# EAGLE schematic pepino4 (EAGLE 6.3)

## Sheet 1 of 4
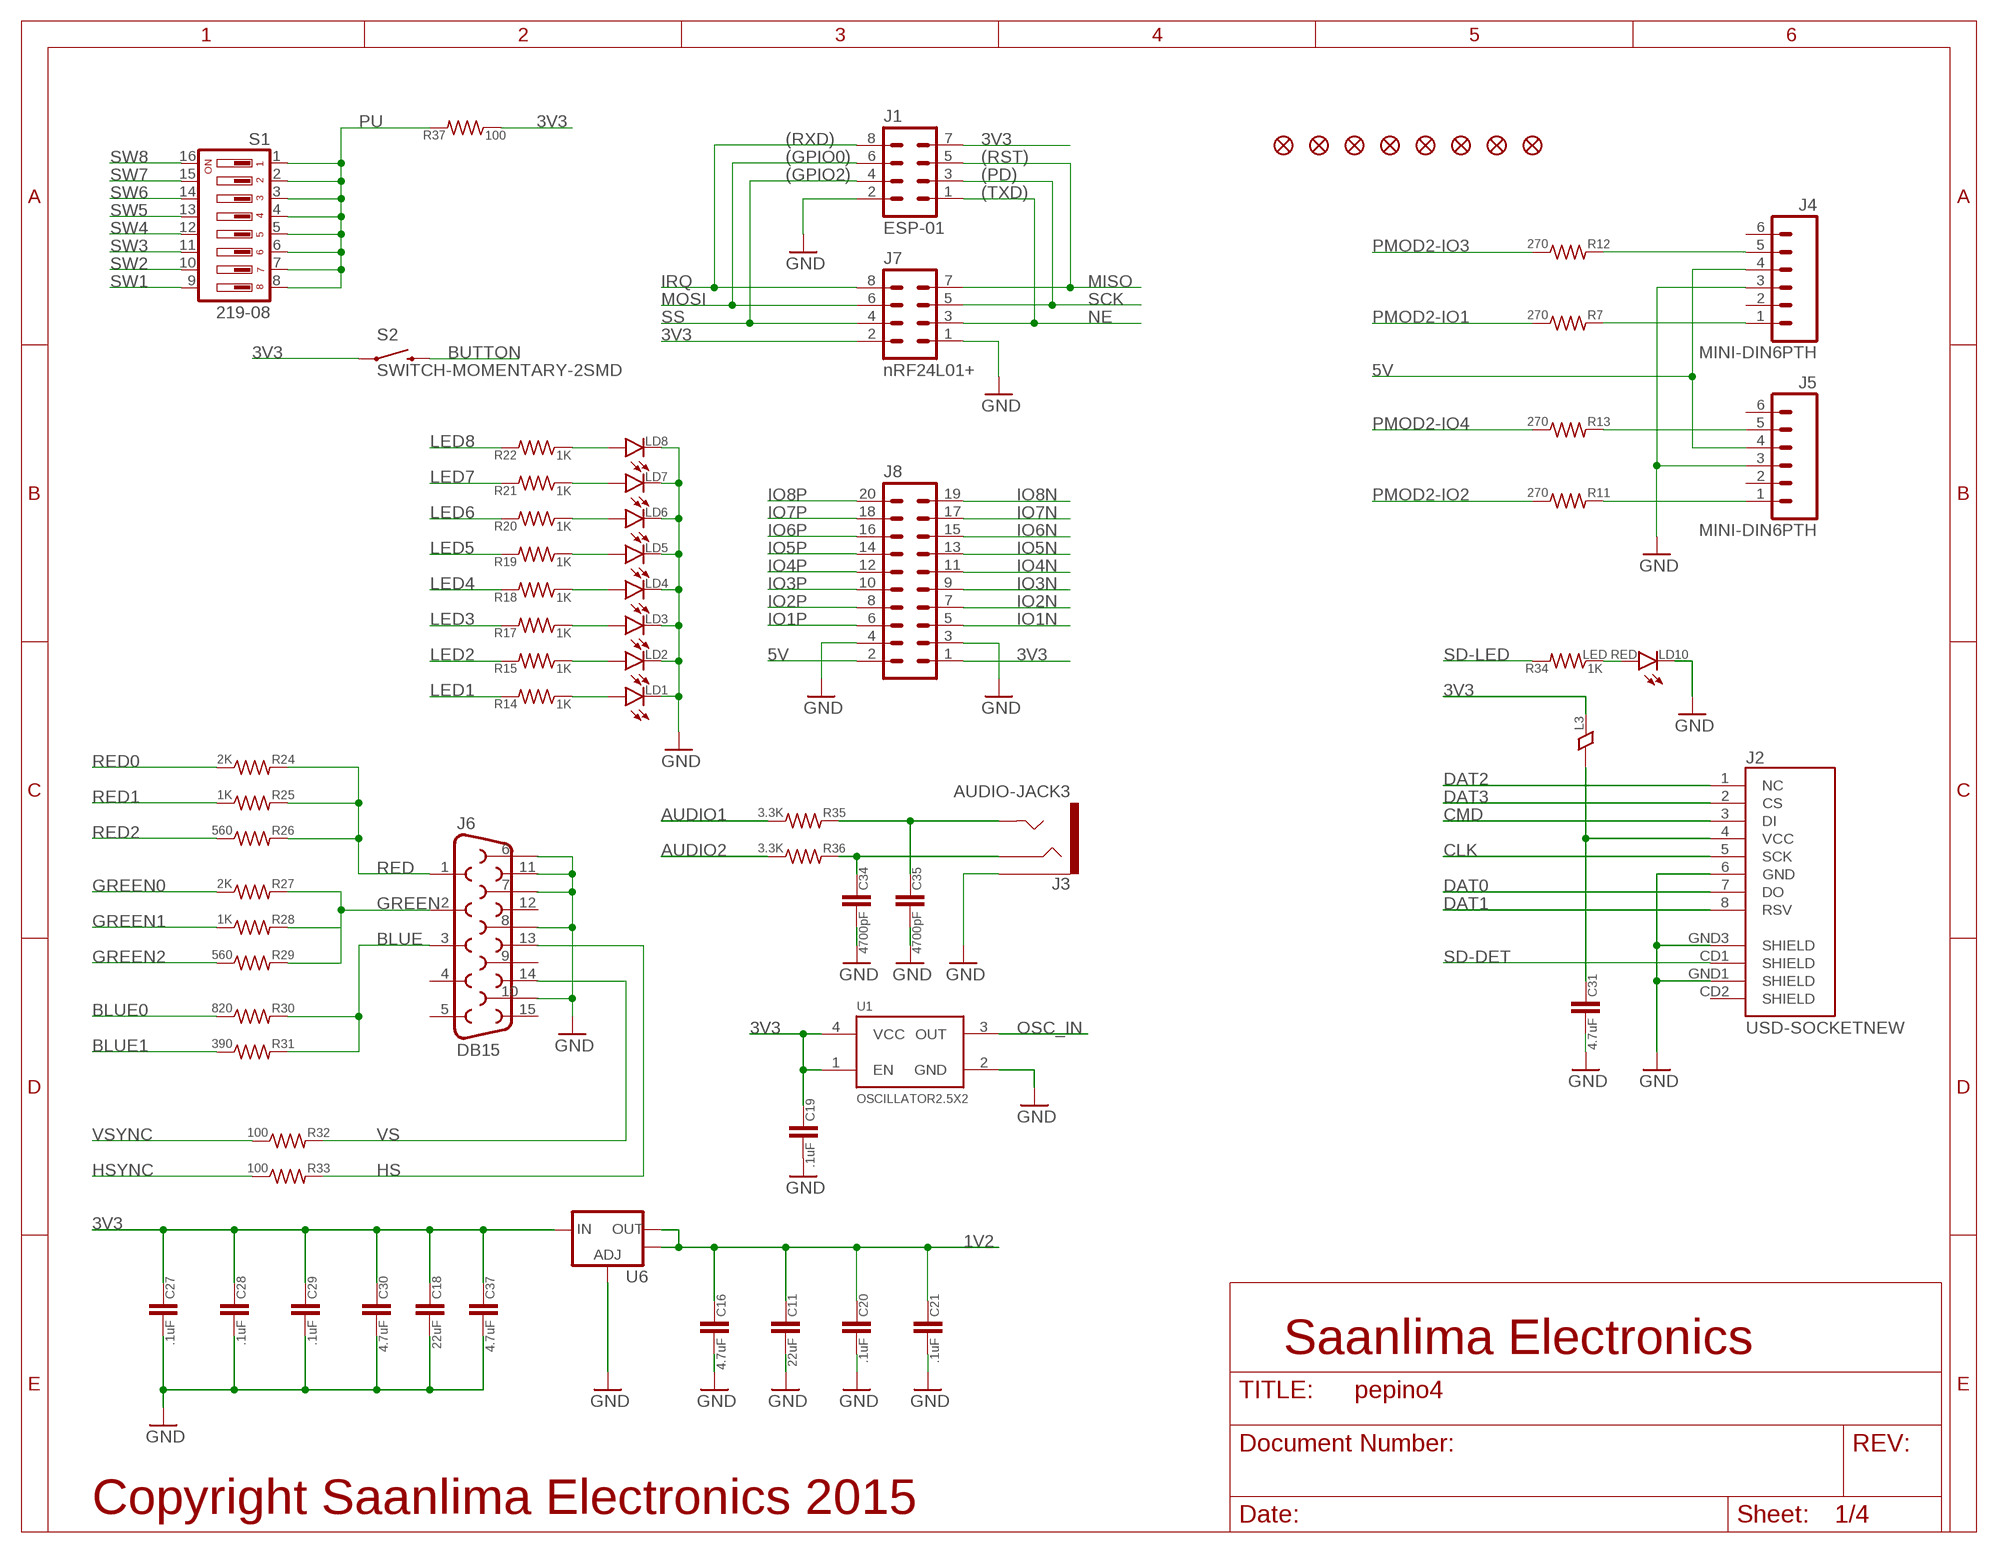
[diagram p0: schematic, sheet 1]

### Parts
C11  22uF  C0805  [0805]
C16  4.7uF  C0402  [0402]
C18  22uF  C0805  [0805]
C19  .1uF  C0402  [0402]
C20  .1uF  C0402  [0402]
C21  .1uF  C0402  [0402]
C27  .1uF  C0402  [0402]
C28  .1uF  C0402  [0402]
C29  .1uF  C0402  [0402]
C30  4.7uF  C0402  [0402]
C31  4.7uF  C0402  [0402]
C34  4700pF  C0402  [0402]
C35  4700pF  C0402  [0402]
C37  4.7uF  C0402  [0402]
J1  ESP-01  MA04-2  [MA04-2]
J2  USD-SOCKETNEW  [MICRO-SD-SOCKET-PP]
J3  AUDIO-JACK3  [AUDIO-JACK-3.5MM-3]
J4  MINI-DIN6PTH  [MINI-DIN6]
J5  MINI-DIN6PTH  [MINI-DIN6]
J6  DB15  [DB15]
J7  nRF24L01+  MA04-2  [MA04-2]
J8  MA10-2  [MA10-2]
JP1  FIDUCIAL1X2  [FIDUCIAL-1X2]
JP2  FIDUCIAL1X2  [FIDUCIAL-1X2]
JP3  FIDUCIAL1X2  [FIDUCIAL-1X2]
JP4  FIDUCIAL1X2  [FIDUCIAL-1X2]
JP5  FIDUCIAL1X2  [FIDUCIAL-1X2]
JP6  FIDUCIAL1X2  [FIDUCIAL-1X2]
JP7  FIDUCIAL1X2  [FIDUCIAL-1X2]
JP8  FIDUCIAL1X2  [FIDUCIAL-1X2]
L3  FERRITE0402  [0402]
LD1  LED0805  [0805_POL]
LD2  LED0805  [0805_POL]
LD3  LED0805  [0805_POL]
LD4  LED0805  [0805_POL]
LD5  LED0805  [0805_POL]
LD6  LED0805  [0805_POL]
LD7  LED0805  [0805_POL]
LD8  LED0805  [0805_POL]
LD10  LED RED  LED0805  [0805_POL]
R7  270  R0402  [0402]
R11  270  R0402  [0402]
R12  270  R0402  [0402]
R13  270  R0402  [0402]
R14  1K  R0402  [0402]
R15  1K  R0402  [0402]
R17  1K  R0402  [0402]
R18  1K  R0402  [0402]
R19  1K  R0402  [0402]
R20  1K  R0402  [0402]
R21  1K  R0402  [0402]
R22  1K  R0402  [0402]
R24  2K  R0402  [0402]
R25  1K  R0402  [0402]
R26  560  R0402  [0402]
R27  2K  R0402  [0402]
R28  1K  R0402  [0402]
R29  560  R0402  [0402]
R30  820  R0402  [0402]
R31  390  R0402  [0402]
R32  100  R0402  [0402]
R33  100  R0402  [0402]
R34  1K  R0402  [0402]
R35  3.3K  R0402  [0402]
R36  3.3K  R0402  [0402]
R37  100  R0402  [0402]
S1  219-08  [CTS-219-08]
S2  SWITCH-MOMENTARY-2SMD  [TACTILE_SWITCH_SMD]
U1  OSCILLATOR2.5X2  [CRYSTAL-OSC-SMD-2.5X2]
U6  V_REG_LM1117SOT223  [SOT223]

### Nets
1V2: C11.1 C16.1 C20.1 C21.1 U6.2(OUT) U6.4(OUT) ; also sheet 4
3V3: C18.1 C19.1 C27.1 C28.1 C29.1 C30.1 C37.1 J1.7 J7.2 J8.1 L3.2 R37.1 S2.1 U1.1(EN) U1.4(VCC) U6.3(IN) ; also sheet 2,3,4
5V: J4.4 J5.4 J8.2 ; also sheet 2
AUDIO1: R35.1 ; also sheet 4
AUDIO2: R36.1 ; also sheet 4
BLUE: J6.3 R30.2 R31.2
BLUE0: R30.1 ; also sheet 4
BLUE1: R31.1 ; also sheet 4
BUTTON: S2.3 ; also sheet 4
CLK: J2.5(SCK) ; also sheet 4
CMD: J2.3(DI) ; also sheet 4
DAT0: J2.7(DO) ; also sheet 4
DAT1: J2.8(RSV) ; also sheet 4
DAT2: J2.1(NC) ; also sheet 4
DAT3: J2.2(CS) ; also sheet 4
GND: C11.2 C16.2 C18.2 C19.2 C20.2 C21.2 C27.2 C28.2 C29.2 C30.2 C31.2 C34.2 C35.2 C37.2 J1.2 J2.6(GND) J2.GND1(SHIELD) J2.GND3(SHIELD) J3.SLEEVE J4.3 J5.3 J6.6 J6.7 J6.8 J6.10 J6.11 J7.1 J8.3 J8.4 LD1.-(C) LD2.-(C) LD3.-(C) LD4.-(C) LD5.-(C) LD6.-(C) LD7.-(C) LD8.-(C) LD10.-(C) U1.2(GND) U6.1(ADJ) ; also sheet 2,3,4
GREEN: J6.2 R27.2 R28.2 R29.2
GREEN0: R27.1 ; also sheet 4
GREEN1: R28.1 ; also sheet 4
GREEN2: R29.1 ; also sheet 4
HS: J6.13 R33.2
HSYNC: R33.1 ; also sheet 4
IO1N: J8.5 ; also sheet 4
IO1P: J8.6 ; also sheet 4
IO2N: J8.7 ; also sheet 4
IO2P: J8.8 ; also sheet 4
IO3N: J8.9 ; also sheet 4
IO3P: J8.10 ; also sheet 4
IO4N: J8.11 ; also sheet 4
IO4P: J8.12 ; also sheet 4
IO5N: J8.13 ; also sheet 4
IO5P: J8.14 ; also sheet 4
IO6N: J8.15 ; also sheet 4
IO6P: J8.16 ; also sheet 4
IO7N: J8.17 ; also sheet 4
IO7P: J8.18 ; also sheet 4
IO8N: J8.19 ; also sheet 4
IO8P: J8.20 ; also sheet 4
IRQ: J1.8 J7.8 ; also sheet 4
LED1: R14.2 ; also sheet 4
LED2: R15.2 ; also sheet 4
LED3: R17.2 ; also sheet 4
LED4: R18.2 ; also sheet 4
LED5: R19.2 ; also sheet 4
LED6: R20.2 ; also sheet 4
LED7: R21.2 ; also sheet 4
LED8: R22.2 ; also sheet 4
MISO: J1.5 J7.7 ; also sheet 4
MOSI: J1.6 J7.6 ; also sheet 4
N$1: J4.1 R7.2
N$4: J5.1 R11.2
N$6: J4.5 R12.2
N$7: C31.1 J2.4(VCC) L3.1
N$8: J5.5 R13.2
N$12: LD1.+(A) R14.1
N$15: LD7.+(A) R21.1
N$22: LD2.+(A) R15.1
N$23: LD3.+(A) R17.1
N$24: LD4.+(A) R18.1
N$25: LD5.+(A) R19.1
N$26: LD6.+(A) R20.1
N$28: LD8.+(A) R22.1
N$29: LD10.+(A) R34.1
N$30: C34.1 J3.RING R36.2
N$31: C35.1 J3.TIP R35.2
NE: J1.1 J7.3 ; also sheet 4
OSC_IN: U1.3(OUT) ; also sheet 4
PMOD2-IO1: R7.1 ; also sheet 4
PMOD2-IO2: R11.1 ; also sheet 4
PMOD2-IO3: R12.1 ; also sheet 4
PMOD2-IO4: R13.1 ; also sheet 4
PU: R37.2 S1.1 S1.2 S1.3 S1.4 S1.5 S1.6 S1.7 S1.8
RED: J6.1 R24.2 R25.2 R26.2
RED0: R24.1 ; also sheet 4
RED1: R25.1 ; also sheet 4
RED2: R26.1 ; also sheet 4
SCK: J1.3 J7.5 ; also sheet 4
SD-DET: J2.CD1(SHIELD) ; also sheet 4
SD-LED: R34.2 ; also sheet 4
SS: J1.4 J7.4 ; also sheet 4
SW1: S1.9 ; also sheet 4
SW2: S1.10 ; also sheet 4
SW3: S1.11 ; also sheet 4
SW4: S1.12 ; also sheet 4
SW5: S1.13 ; also sheet 4
SW6: S1.14 ; also sheet 4
SW7: S1.15 ; also sheet 4
SW8: S1.16 ; also sheet 4
VS: J6.14 R32.2
VSYNC: R32.1 ; also sheet 4
Unconnected: J2.CD2(SHIELD) J4.2 J4.6 J5.2 J5.6 J6.4 J6.5 J6.9 J6.12 J6.15

### Notes on the sheet
- (RXD)
- (GPIO0) | (RST)
- (GPIO2) | (PD)
- (TXD)
- Saanlima Electronics
- Copyright Saanlima Electronics 2015

## Sheet 2 of 4
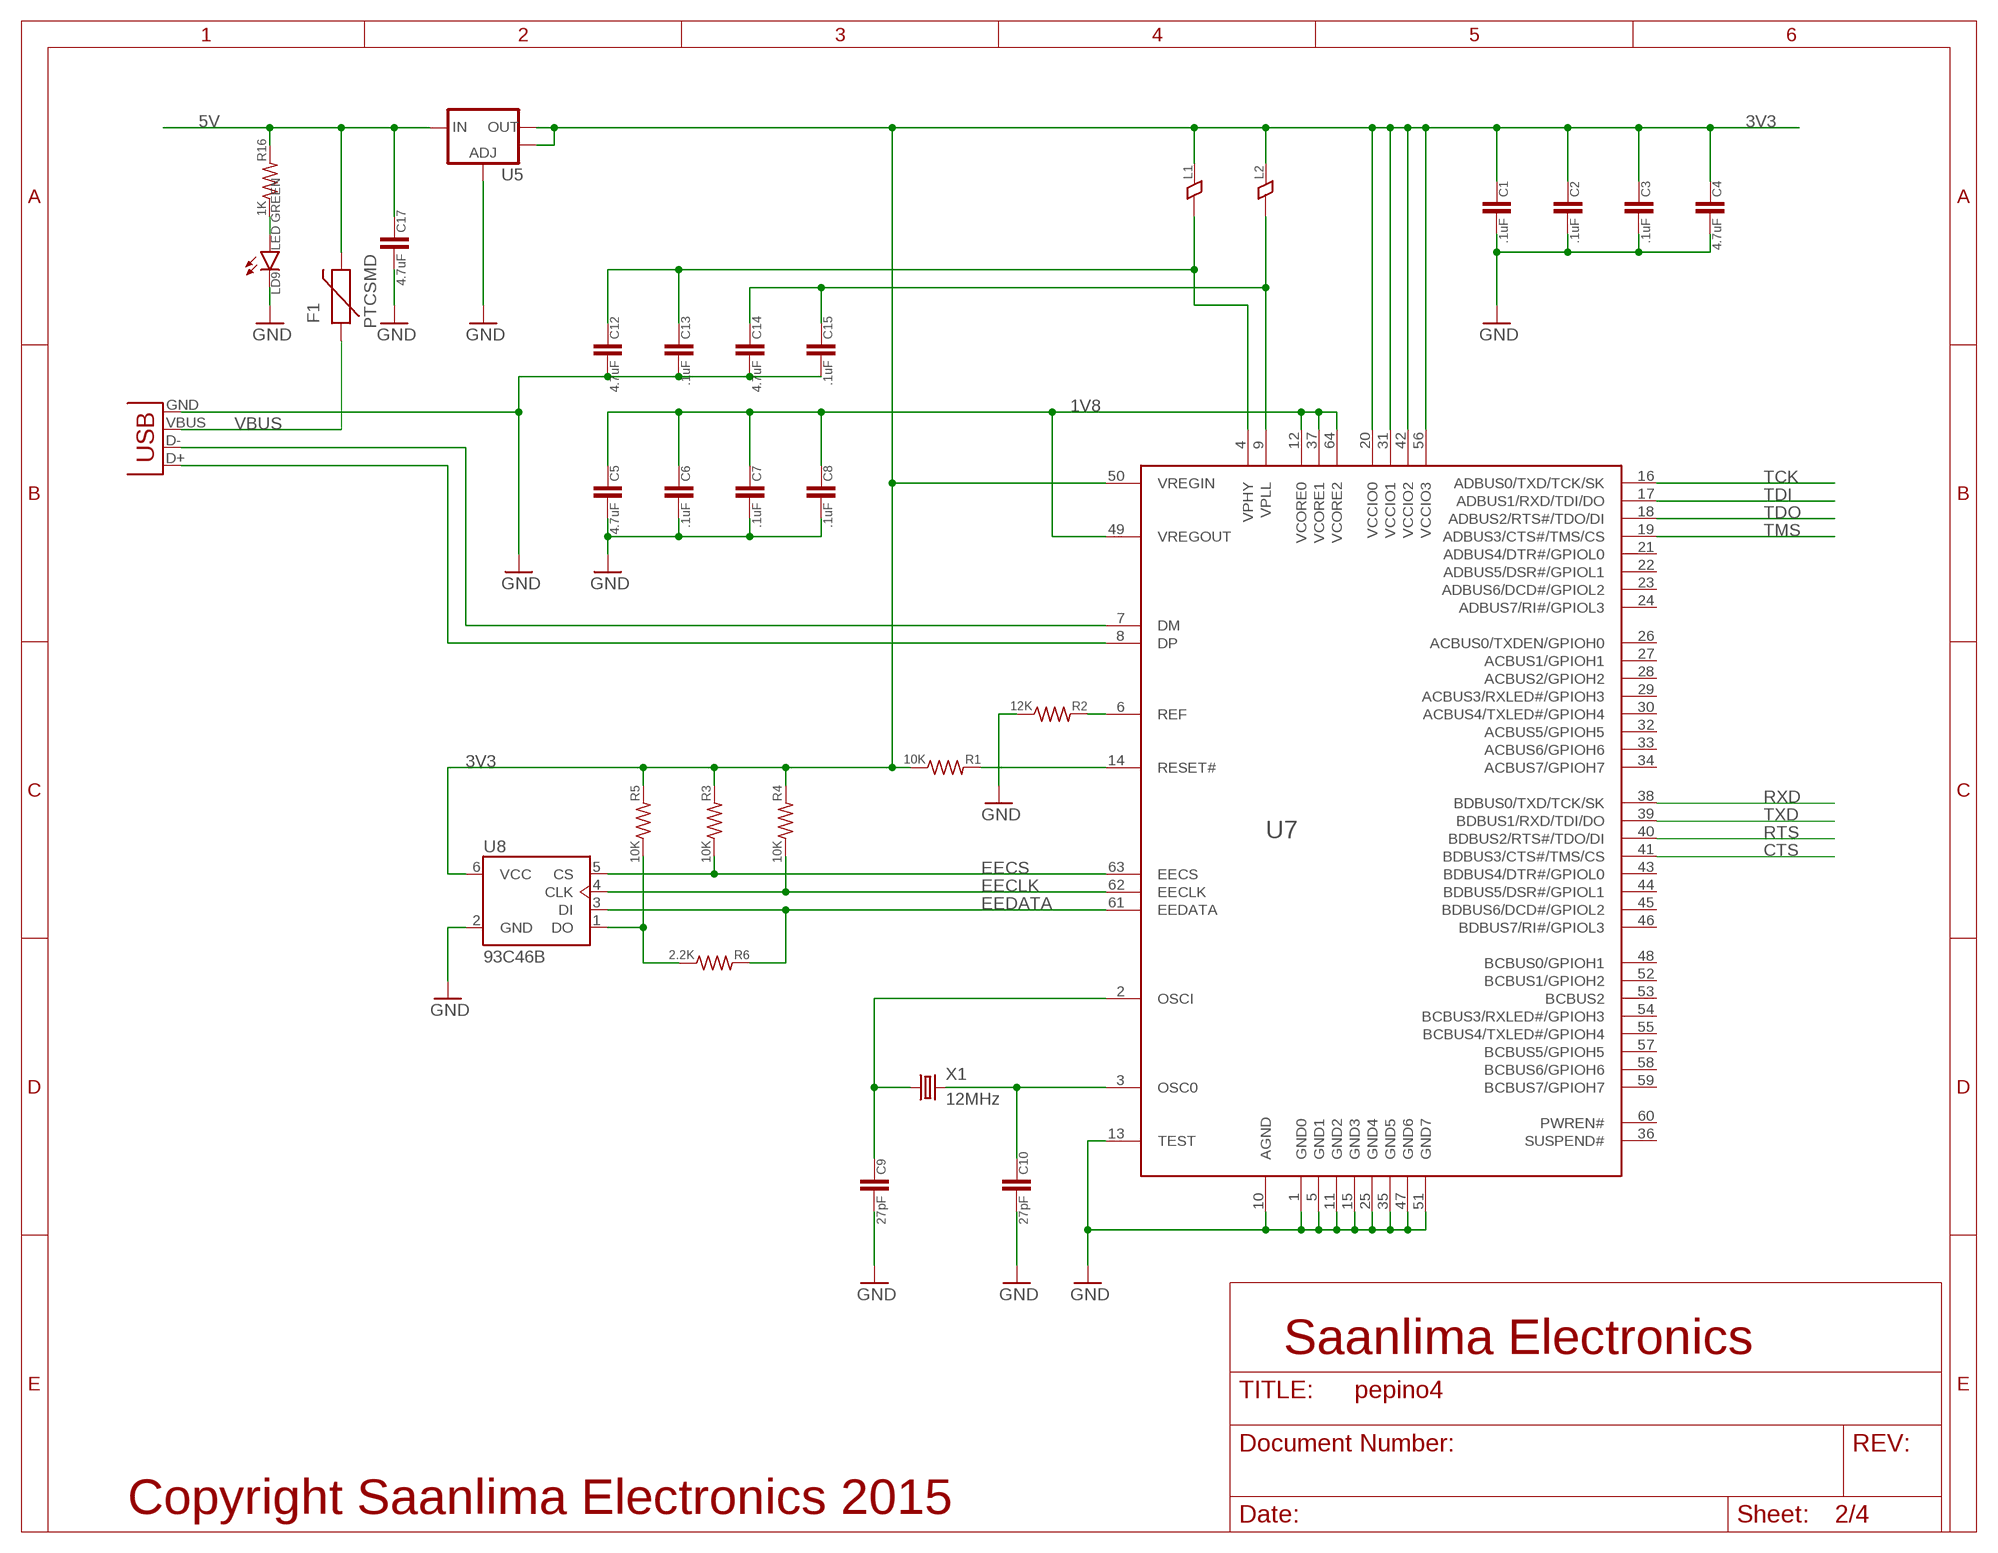
[diagram p1: schematic, sheet 2]

### Parts
C1  .1uF  C0402  [0402]
C2  .1uF  C0402  [0402]
C3  .1uF  C0402  [0402]
C4  4.7uF  C0402  [0402]
C5  4.7uF  C0402  [0402]
C6  .1uF  C0402  [0402]
C7  .1uF  C0402  [0402]
C8  .1uF  C0402  [0402]
C9  27pF  C0402  [0402]
C10  27pF  C0402  [0402]
C12  4.7uF  C0402  [0402]
C13  .1uF  C0402  [0402]
C14  4.7uF  C0402  [0402]
C15  .1uF  C0402  [0402]
C17  4.7uF  C0603  [0603]
F1  PTCSMD  [PTC-1206]
J9  USBSMD  [USB-MINIB]
L1  FERRITE0402  [0402]
L2  FERRITE0402  [0402]
LD9  LED GREEN  LED0805  [0805_POL]
R1  10K  R0402  [0402]
R2  12K  R0402  [0402]
R3  10K  R0402  [0402]
R4  10K  R0402  [0402]
R5  10K  R0402  [0402]
R6  2.2K  R0402  [0402]
R16  1K  R0402  [0402]
U5  V_REG_LM1117SOT223  [SOT223]
U7  DP-EAGLELIBRARY_FT2232H  [DP-EAGLELIBRARY_LQFP64]
U8  93C46B  DIGITAL-EEPROM-MICROWIRE-6P_SOT23  [SOT23-6]
X1  12MHz  CRYSTAL3.2X2.5  [CRYSTAL3.2X2.5MM]

### Nets
1V8: C5.1 C6.1 C7.1 C8.1 U7.12(VCORE0) U7.37(VCORE1) U7.49(VREGOUT) U7.64(VCORE2)
3V3: C1.1 C2.1 C3.1 C4.1 L1.2 L2.2 R1.1 R3.2 R4.2 R5.2 U5.2(OUT) U5.4(OUT) U7.20(VCCIO0) U7.31(VCCIO1) U7.42(VCCIO2) U7.50(VREGIN) U7.56(VCCIO3) U8.6(VCC) ; also sheet 1,3,4
5V: C17.1 F1.2 R16.2 U5.3(IN) ; also sheet 1
CTS: U7.41(BDBUS3/CTS#/TMS/CS) ; also sheet 4
EECLK: R4.1 U7.62(EECLK) U8.4(CLK)
EECS: R3.1 U7.63(EECS) U8.5(CS)
EEDATA: R6.2 U7.61(EEDATA) U8.3(DI)
GND: C1.2 C2.2 C3.2 C4.2 C5.2 C6.2 C7.2 C8.2 C9.2 C10.2 C12.2 C13.2 C14.2 C15.2 C17.2 J9.GND LD9.-(C) R2.1 U5.1(ADJ) U7.1(GND0) U7.5(GND1) U7.10(AGND) U7.11(GND2) U7.13(TEST) U7.15(GND3) U7.25(GND4) U7.35(GND5) U7.47(GND6) U7.51(GND7) U8.2(GND) ; also sheet 1,3,4
N$9: C9.1 U7.2(OSCI) X1.1
N$10: C10.1 U7.3(OSC0) X1.3
N$11: LD9.+(A) R16.1
N$13: J9.D- U7.7(DM)
N$14: J9.D+ U7.8(DP)
N$18: C14.1 C15.1 L2.1 U7.9(VPLL)
N$19: R1.2 U7.14(RESET#)
N$20: R2.2 U7.6(REF)
N$21: C12.1 C13.1 L1.1 U7.4(VPHY)
N$27: R5.1 R6.1 U8.1(DO)
RTS: U7.40(BDBUS2/RTS#/TDO/DI) ; also sheet 4
RXD: U7.38(BDBUS0/TXD/TCK/SK) ; also sheet 4
TCK: U7.16(ADBUS0/TXD/TCK/SK) ; also sheet 4
TDI: U7.17(ADBUS1/RXD/TDI/DO) ; also sheet 4
TDO: U7.18(ADBUS2/RTS#/TDO/DI) ; also sheet 4
TMS: U7.19(ADBUS3/CTS#/TMS/CS) ; also sheet 4
TXD: U7.39(BDBUS1/RXD/TDI/DO) ; also sheet 4
VBUS [power]: F1.1 J9.VBUS
Unconnected: U7.21(ADBUS4/DTR#/GPIOL0) U7.22(ADBUS5/DSR#/GPIOL1) U7.23(ADBUS6/DCD#/GPIOL2) U7.24(ADBUS7/RI#/GPIOL3) U7.26(ACBUS0/TXDEN/GPIOH0) U7.27(ACBUS1/GPIOH1) U7.28(ACBUS2/GPIOH2) U7.29(ACBUS3/RXLED#/GPIOH3) U7.30(ACBUS4/TXLED#/GPIOH4) U7.32(ACBUS5/GPIOH5) U7.33(ACBUS6/GPIOH6) U7.34(ACBUS7/GPIOH7) U7.36(SUSPEND#) U7.43(BDBUS4/DTR#/GPIOL0) U7.44(BDBUS5/DSR#/GPIOL1) U7.45(BDBUS6/DCD#/GPIOL2) U7.46(BDBUS7/RI#/GPIOL3) U7.48(BCBUS0/GPIOH1) U7.52(BCBUS1/GPIOH2) U7.53(BCBUS2) U7.54(BCBUS3/RXLED#/GPIOH3) U7.55(BCBUS4/TXLED#/GPIOH4) U7.57(BCBUS5/GPIOH5) U7.58(BCBUS6/GPIOH6) U7.59(BCBUS7/GPIOH7) U7.60(PWREN#)

### Notes on the sheet
- Saanlima Electronics
- Copyright Saanlima Electronics 2015

## Sheet 3 of 4
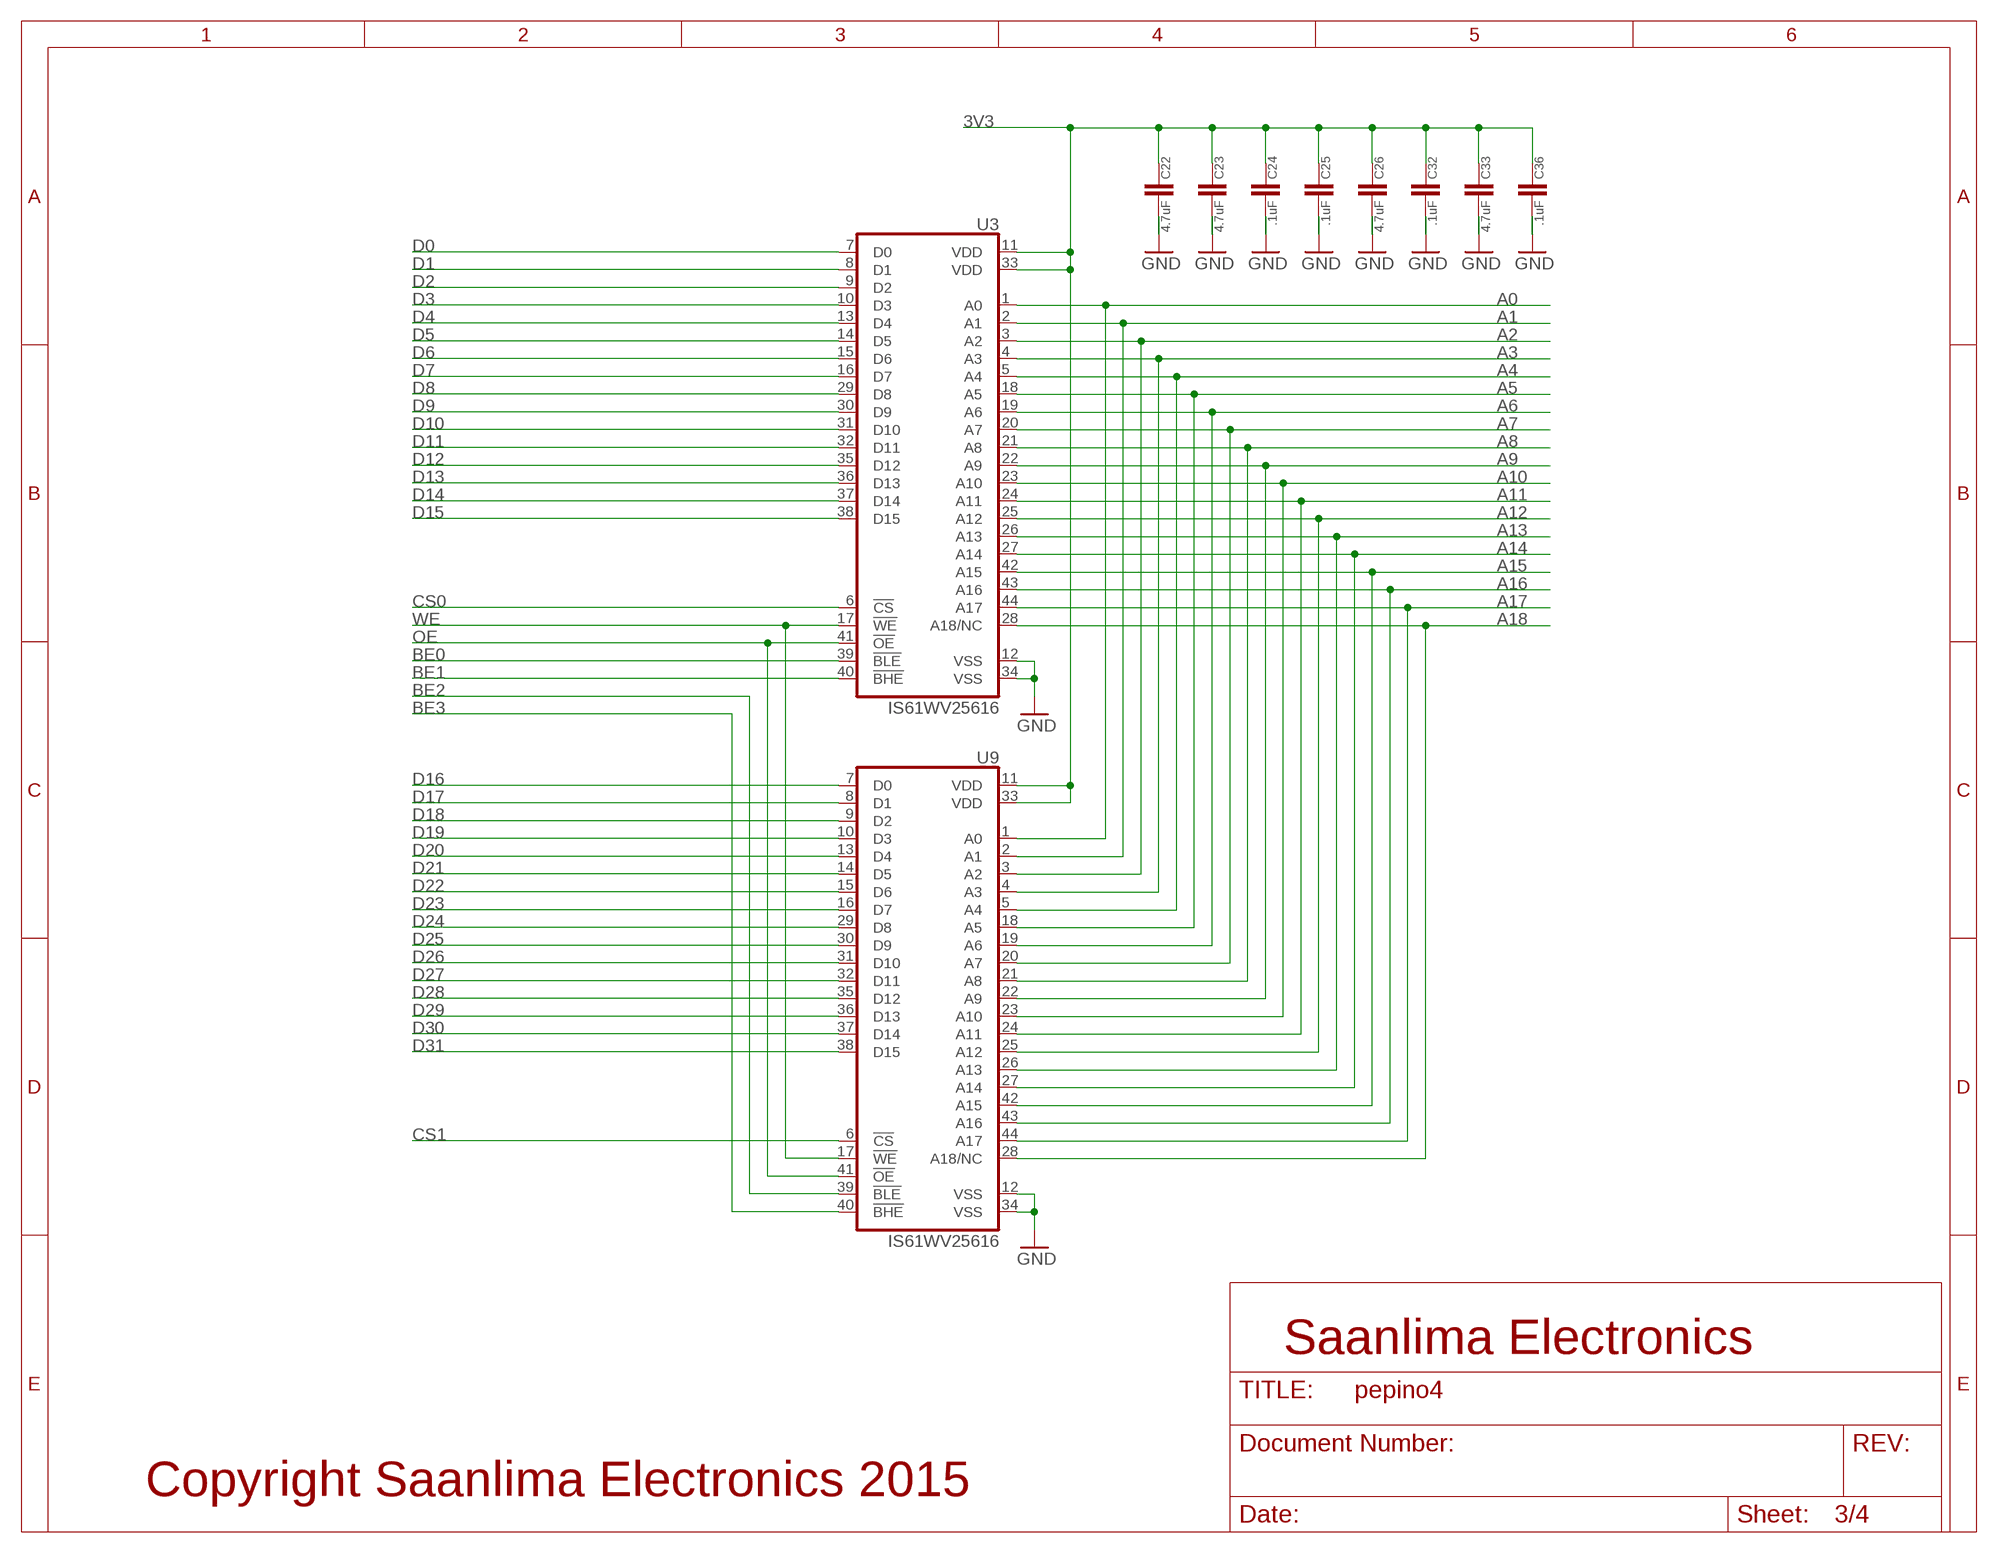
[diagram p2: schematic, sheet 3]

### Parts
C22  4.7uF  C0402  [0402]
C23  4.7uF  C0402  [0402]
C24  .1uF  C0402  [0402]
C25  .1uF  C0402  [0402]
C26  4.7uF  C0402  [0402]
C32  .1uF  C0402  [0402]
C33  4.7uF  C0402  [0402]
C36  .1uF  C0402  [0402]
U3  IS61WV25616  DIGITAL_4MB_SRAM  [TSOP44-II]
U9  IS61WV25616  DIGITAL_4MB_SRAM  [TSOP44-II]

### Nets
3V3: C22.1 C23.1 C24.1 C25.1 C26.1 C32.1 C33.1 C36.1 U3.11(VDD) U3.33(VDD) U9.11(VDD) U9.33(VDD) ; also sheet 1,2,4
A0: U3.1(A0) U9.1(A0) ; also sheet 4
A1: U3.2(A1) U9.2(A1) ; also sheet 4
A2: U3.3(A2) U9.3(A2) ; also sheet 4
A3: U3.4(A3) U9.4(A3) ; also sheet 4
A4: U3.5(A4) U9.5(A4) ; also sheet 4
A5: U3.18(A5) U9.18(A5) ; also sheet 4
A6: U3.19(A6) U9.19(A6) ; also sheet 4
A7: U3.20(A7) U9.20(A7) ; also sheet 4
A8: U3.21(A8) U9.21(A8) ; also sheet 4
A9: U3.22(A9) U9.22(A9) ; also sheet 4
A10: U3.23(A10) U9.23(A10) ; also sheet 4
A11: U3.24(A11) U9.24(A11) ; also sheet 4
A12: U3.25(A12) U9.25(A12) ; also sheet 4
A13: U3.26(A13) U9.26(A13) ; also sheet 4
A14: U3.27(A14) U9.27(A14) ; also sheet 4
A15: U3.42(A15) U9.42(A15) ; also sheet 4
A16: U3.43(A16) U9.43(A16) ; also sheet 4
A17: U3.44(A17) U9.44(A17) ; also sheet 4
A18: U3.28(A18/NC) U9.28(A18/NC) ; also sheet 4
BE0: U3.39(!BLE) ; also sheet 4
BE1: U3.40(!BHE) ; also sheet 4
BE2: U9.39(!BLE) ; also sheet 4
BE3: U9.40(!BHE) ; also sheet 4
CS0: U3.6(!CS) ; also sheet 4
CS1: U9.6(!CS) ; also sheet 4
D0: U3.7(D0) ; also sheet 4
D1: U3.8(D1) ; also sheet 4
D2: U3.9(D2) ; also sheet 4
D3: U3.10(D3) ; also sheet 4
D4: U3.13(D4) ; also sheet 4
D5: U3.14(D5) ; also sheet 4
D6: U3.15(D6) ; also sheet 4
D7: U3.16(D7) ; also sheet 4
D8: U3.29(D8) ; also sheet 4
D9: U3.30(D9) ; also sheet 4
D10: U3.31(D10) ; also sheet 4
D11: U3.32(D11) ; also sheet 4
D12: U3.35(D12) ; also sheet 4
D13: U3.36(D13) ; also sheet 4
D14: U3.37(D14) ; also sheet 4
D15: U3.38(D15) ; also sheet 4
D16: U9.7(D0) ; also sheet 4
D17: U9.8(D1) ; also sheet 4
D18: U9.9(D2) ; also sheet 4
D19: U9.10(D3) ; also sheet 4
D20: U9.13(D4) ; also sheet 4
D21: U9.14(D5) ; also sheet 4
D22: U9.15(D6) ; also sheet 4
D23: U9.16(D7) ; also sheet 4
D24: U9.29(D8) ; also sheet 4
D25: U9.30(D9) ; also sheet 4
D26: U9.31(D10) ; also sheet 4
D27: U9.32(D11) ; also sheet 4
D28: U9.35(D12) ; also sheet 4
D29: U9.36(D13) ; also sheet 4
D30: U9.37(D14) ; also sheet 4
D31: U9.38(D15) ; also sheet 4
GND: C22.2 C23.2 C24.2 C25.2 C26.2 C32.2 C33.2 C36.2 U3.12(VSS) U3.34(VSS) U9.12(VSS) U9.34(VSS) ; also sheet 1,2,4
OE: U3.41(!OE) U9.41(!OE) ; also sheet 4
WE: U3.17(!WE) U9.17(!WE) ; also sheet 4

### Notes on the sheet
- Saanlima Electronics
- Copyright Saanlima Electronics 2015

## Sheet 4 of 4
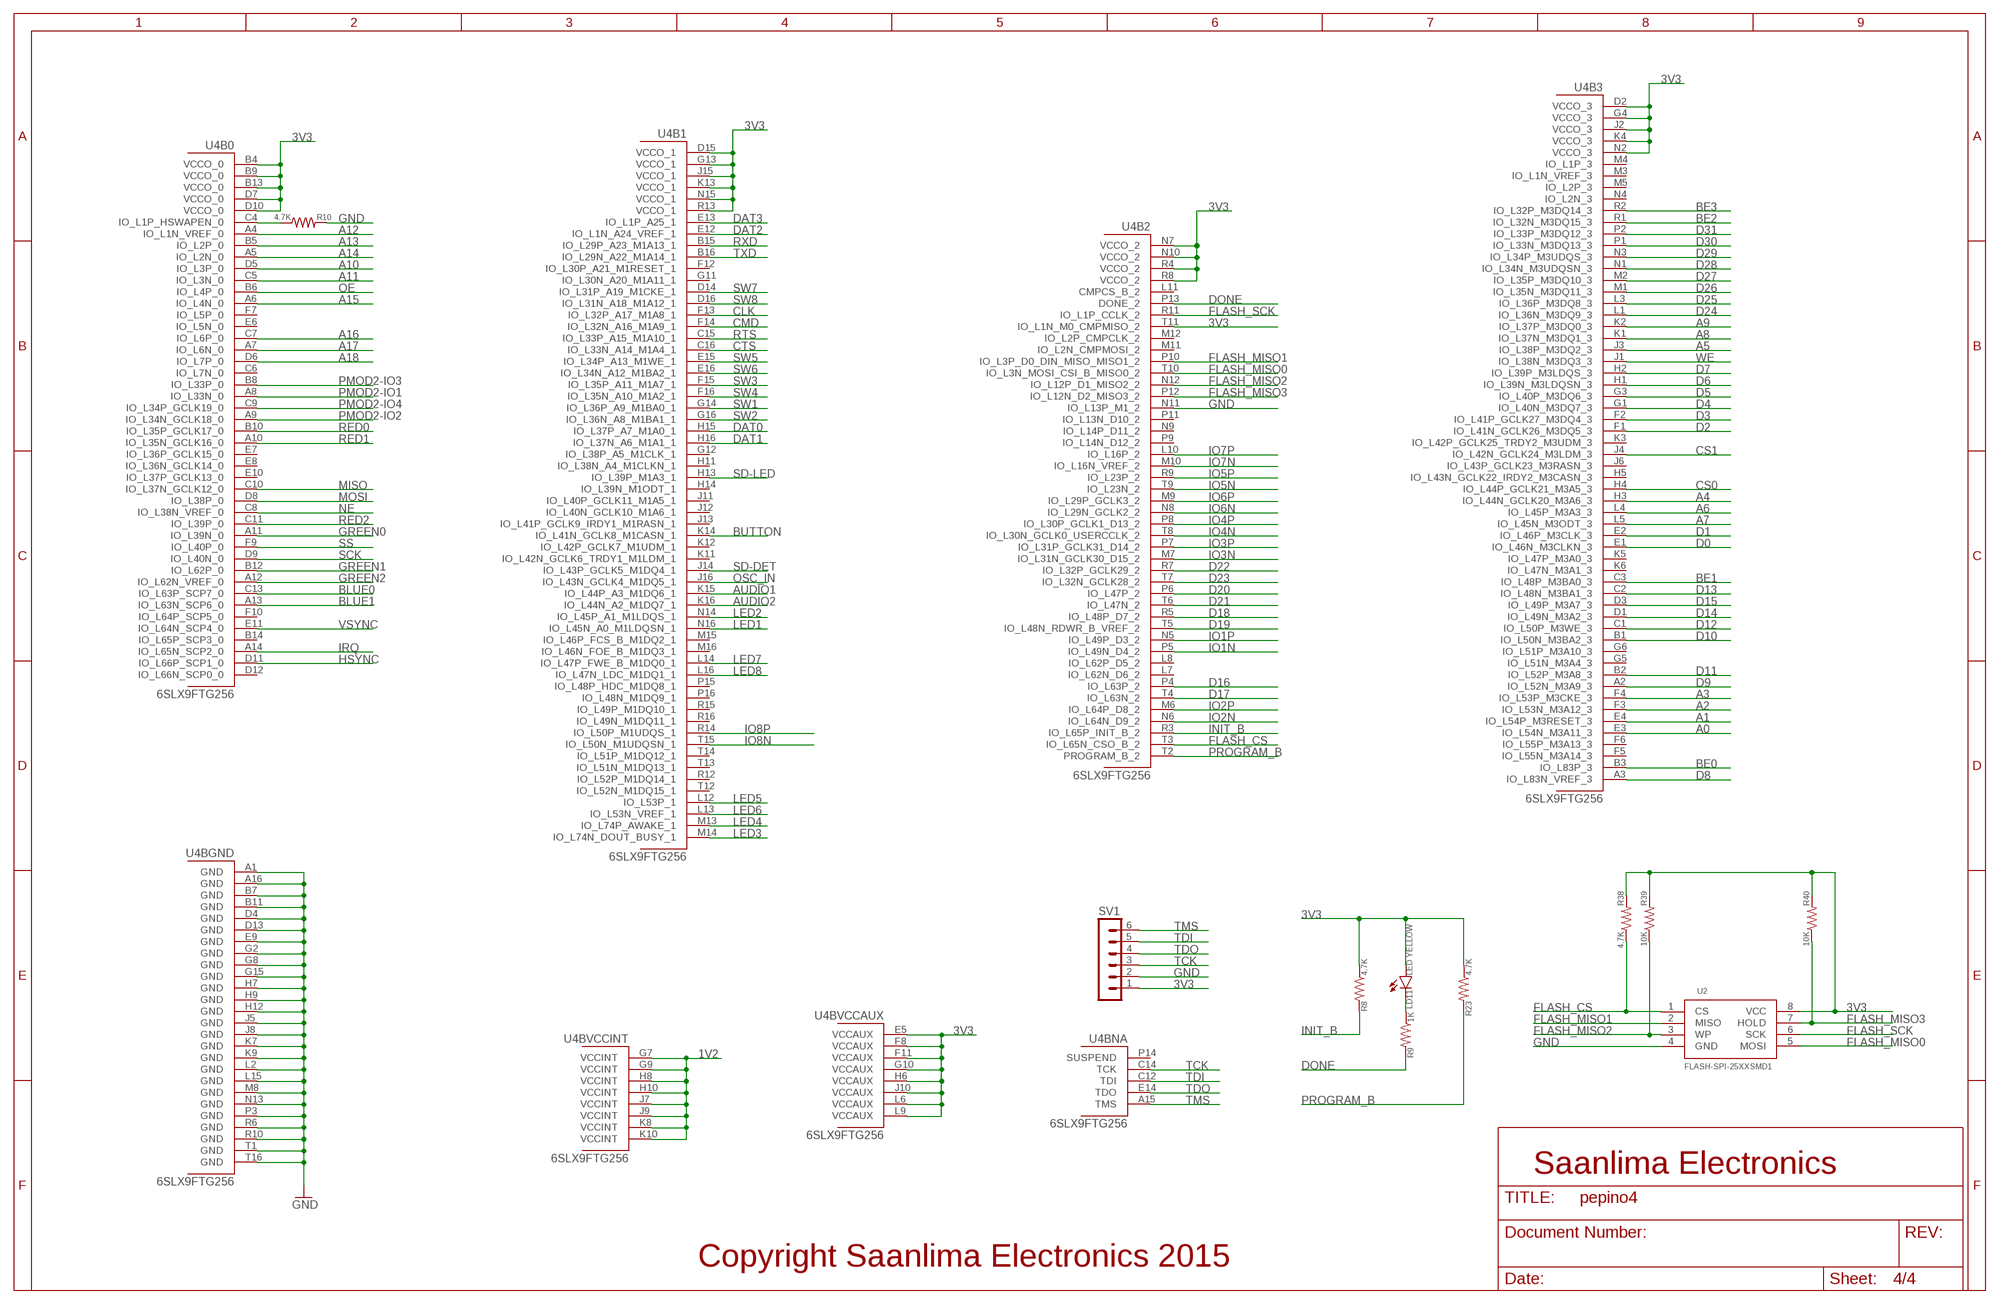
[diagram p3: schematic, sheet 4]

### Parts
LD11  LED YELLOW  LED0805  [0805_POL]
R8  4.7K  R0402  [0402]
R9  1K  R0402  [0402]
R10  4.7K  R0402  [0402]
R23  4.7K  R0402  [0402]
R38  4.7K  R0402  [0402]
R39  10K  R0402  [0402]
R40  10K  R0402  [0402]
SV1  MA06-1  [MA06-1]
U2  FLASH-SPI-25XXSMD1  [SO08-EIAJ]
U4  6SLX9FTG256  [FT256]

### Nets
1V2: U4.G7(BVCCINT:VCCINT) U4.G9(BVCCINT:VCCINT) U4.H8(BVCCINT:VCCINT) U4.H10(BVCCINT:VCCINT) U4.J7(BVCCINT:VCCINT) U4.J9(BVCCINT:VCCINT) U4.K8(BVCCINT:VCCINT) U4.K10(BVCCINT:VCCINT) ; also sheet 1
3V3: LD11.+(A) R8.1 R23.1 R38.2 R39.2 R40.2 SV1.1 U2.8(VCC) U4.B4(B0:VCCO_0) U4.B9(B0:VCCO_0) U4.B13(B0:VCCO_0) U4.D2(B3:VCCO_3) U4.D7(B0:VCCO_0) U4.D10(B0:VCCO_0) U4.D15(B1:VCCO_1) U4.E5(BVCCAUX:VCCAUX) U4.F8(BVCCAUX:VCCAUX) U4.F11(BVCCAUX:VCCAUX) U4.G4(B3:VCCO_3) U4.G10(BVCCAUX:VCCAUX) U4.G13(B1:VCCO_1) U4.H6(BVCCAUX:VCCAUX) U4.J2(B3:VCCO_3) U4.J10(BVCCAUX:VCCAUX) U4.J15(B1:VCCO_1) U4.K4(B3:VCCO_3) U4.K13(B1:VCCO_1) U4.L6(BVCCAUX:VCCAUX) U4.L9(BVCCAUX:VCCAUX) U4.N2(B3:VCCO_3) U4.N7(B2:VCCO_2) U4.N10(B2:VCCO_2) U4.N15(B1:VCCO_1) U4.R4(B2:VCCO_2) U4.R8(B2:VCCO_2) U4.R13(B1:VCCO_1) U4.T11(B2:IO_L1N_M0_CMPMISO_2) ; also sheet 1,2,3
A0: U4.E3(B3:IO_L54N_M3A11_3) ; also sheet 3
A1: U4.E4(B3:IO_L54P_M3RESET_3) ; also sheet 3
A2: U4.F3(B3:IO_L53N_M3A12_3) ; also sheet 3
A3: U4.F4(B3:IO_L53P_M3CKE_3) ; also sheet 3
A4: U4.H3(B3:IO_L44N_GCLK20_M3A6_3) ; also sheet 3
A5: U4.J3(B3:IO_L38P_M3DQ2_3) ; also sheet 3
A6: U4.L4(B3:IO_L45P_M3A3_3) ; also sheet 3
A7: U4.L5(B3:IO_L45N_M3ODT_3) ; also sheet 3
A8: U4.K1(B3:IO_L37N_M3DQ1_3) ; also sheet 3
A9: U4.K2(B3:IO_L37P_M3DQ0_3) ; also sheet 3
A10: U4.D5(B0:IO_L3P_0) ; also sheet 3
A11: U4.C5(B0:IO_L3N_0) ; also sheet 3
A12: U4.A4(B0:IO_L1N_VREF_0) ; also sheet 3
A13: U4.B5(B0:IO_L2P_0) ; also sheet 3
A14: U4.A5(B0:IO_L2N_0) ; also sheet 3
A15: U4.A6(B0:IO_L4N_0) ; also sheet 3
A16: U4.C7(B0:IO_L6P_0) ; also sheet 3
A17: U4.A7(B0:IO_L6N_0) ; also sheet 3
A18: U4.D6(B0:IO_L7P_0) ; also sheet 3
AUDIO1: U4.K15(B1:IO_L44P_A3_M1DQ6_1) ; also sheet 1
AUDIO2: U4.K16(B1:IO_L44N_A2_M1DQ7_1) ; also sheet 1
BE0: U4.B3(B3:IO_L83P_3) ; also sheet 3
BE1: U4.C3(B3:IO_L48P_M3BA0_3) ; also sheet 3
BE2: U4.R1(B3:IO_L32N_M3DQ15_3) ; also sheet 3
BE3: U4.R2(B3:IO_L32P_M3DQ14_3) ; also sheet 3
BLUE0: U4.C13(B0:IO_L63P_SCP7_0) ; also sheet 1
BLUE1: U4.A13(B0:IO_L63N_SCP6_0) ; also sheet 1
BUTTON: U4.K14(B1:IO_L41N_GCLK8_M1CASN_1) ; also sheet 1
CLK: U4.F13(B1:IO_L32P_A17_M1A8_1) ; also sheet 1
CMD: U4.F14(B1:IO_L32N_A16_M1A9_1) ; also sheet 1
CS0: U4.H4(B3:IO_L44P_GCLK21_M3A5_3) ; also sheet 3
CS1: U4.J4(B3:IO_L42N_GCLK24_M3LDM_3) ; also sheet 3
CTS: U4.C16(B1:IO_L33N_A14_M1A4_1) ; also sheet 2
D0: U4.E1(B3:IO_L46N_M3CLKN_3) ; also sheet 3
D1: U4.E2(B3:IO_L46P_M3CLK_3) ; also sheet 3
D2: U4.F1(B3:IO_L41N_GCLK26_M3DQ5_3) ; also sheet 3
D3: U4.F2(B3:IO_L41P_GCLK27_M3DQ4_3) ; also sheet 3
D4: U4.G1(B3:IO_L40N_M3DQ7_3) ; also sheet 3
D5: U4.G3(B3:IO_L40P_M3DQ6_3) ; also sheet 3
D6: U4.H1(B3:IO_L39N_M3LDQSN_3) ; also sheet 3
D7: U4.H2(B3:IO_L39P_M3LDQS_3) ; also sheet 3
D8: U4.A3(B3:IO_L83N_VREF_3) ; also sheet 3
D9: U4.A2(B3:IO_L52N_M3A9_3) ; also sheet 3
D10: U4.B1(B3:IO_L50N_M3BA2_3) ; also sheet 3
D11: U4.B2(B3:IO_L52P_M3A8_3) ; also sheet 3
D12: U4.C1(B3:IO_L50P_M3WE_3) ; also sheet 3
D13: U4.C2(B3:IO_L48N_M3BA1_3) ; also sheet 3
D14: U4.D1(B3:IO_L49N_M3A2_3) ; also sheet 3
D15: U4.D3(B3:IO_L49P_M3A7_3) ; also sheet 3
D16: U4.P4(B2:IO_L63P_2) ; also sheet 3
D17: U4.T4(B2:IO_L63N_2) ; also sheet 3
D18: U4.R5(B2:IO_L48P_D7_2) ; also sheet 3
D19: U4.T5(B2:IO_L48N_RDWR_B_VREF_2) ; also sheet 3
D20: U4.P6(B2:IO_L47P_2) ; also sheet 3
D21: U4.T6(B2:IO_L47N_2) ; also sheet 3
D22: U4.R7(B2:IO_L32P_GCLK29_2) ; also sheet 3
D23: U4.T7(B2:IO_L32N_GCLK28_2) ; also sheet 3
D24: U4.L1(B3:IO_L36N_M3DQ9_3) ; also sheet 3
D25: U4.L3(B3:IO_L36P_M3DQ8_3) ; also sheet 3
D26: U4.M1(B3:IO_L35N_M3DQ11_3) ; also sheet 3
D27: U4.M2(B3:IO_L35P_M3DQ10_3) ; also sheet 3
D28: U4.N1(B3:IO_L34N_M3UDQSN_3) ; also sheet 3
D29: U4.N3(B3:IO_L34P_M3UDQS_3) ; also sheet 3
D30: U4.P1(B3:IO_L33N_M3DQ13_3) ; also sheet 3
D31: U4.P2(B3:IO_L33P_M3DQ12_3) ; also sheet 3
DAT0: U4.H15(B1:IO_L37P_A7_M1A0_1) ; also sheet 1
DAT1: U4.H16(B1:IO_L37N_A6_M1A1_1) ; also sheet 1
DAT2: U4.E12(B1:IO_L1N_A24_VREF_1) ; also sheet 1
DAT3: U4.E13(B1:IO_L1P_A25_1) ; also sheet 1
DONE: R9.2 U4.P13(B2:DONE_2)
FLASH_CS: R38.1 U2.1(CS) U4.T3(B2:IO_L65N_CSO_B_2)
FLASH_MISO0: U2.5(MOSI) U4.T10(B2:IO_L3N_MOSI_CSI_B_MISO0_2)
FLASH_MISO1: U2.2(MISO) U4.P10(B2:IO_L3P_D0_DIN_MISO_MISO1_2)
FLASH_MISO2: R39.1 U2.3(WP) U4.N12(B2:IO_L12P_D1_MISO2_2)
FLASH_MISO3: R40.1 U2.7(HOLD) U4.P12(B2:IO_L12N_D2_MISO3_2)
FLASH_SCK: U2.6(SCK) U4.R11(B2:IO_L1P_CCLK_2)
GND: R10.2 SV1.2 U2.4(GND) U4.A1(BGND:GND) U4.A16(BGND:GND) U4.B7(BGND:GND) U4.B11(BGND:GND) U4.D4(BGND:GND) U4.D13(BGND:GND) U4.E9(BGND:GND) U4.G2(BGND:GND) U4.G8(BGND:GND) U4.G15(BGND:GND) U4.H7(BGND:GND) U4.H9(BGND:GND) U4.H12(BGND:GND) U4.J5(BGND:GND) U4.J8(BGND:GND) U4.K7(BGND:GND) U4.K9(BGND:GND) U4.L2(BGND:GND) U4.L15(BGND:GND) U4.M8(BGND:GND) U4.N11(B2:IO_L13P_M1_2) U4.N13(BGND:GND) U4.P3(BGND:GND) U4.R6(BGND:GND) U4.R10(BGND:GND) U4.T1(BGND:GND) U4.T16(BGND:GND) ; also sheet 1,2,3
GREEN0: U4.A11(B0:IO_L39N_0) ; also sheet 1
GREEN1: U4.B12(B0:IO_L62P_0) ; also sheet 1
GREEN2: U4.A12(B0:IO_L62N_VREF_0) ; also sheet 1
HSYNC: U4.D11(B0:IO_L66P_SCP1_0) ; also sheet 1
INIT_B: R8.2 U4.R3(B2:IO_L65P_INIT_B_2)
IO1N: U4.P5(B2:IO_L49N_D4_2) ; also sheet 1
IO1P: U4.N5(B2:IO_L49P_D3_2) ; also sheet 1
IO2N: U4.N6(B2:IO_L64N_D9_2) ; also sheet 1
IO2P: U4.M6(B2:IO_L64P_D8_2) ; also sheet 1
IO3N: U4.M7(B2:IO_L31N_GCLK30_D15_2) ; also sheet 1
IO3P: U4.P7(B2:IO_L31P_GCLK31_D14_2) ; also sheet 1
IO4N: U4.T8(B2:IO_L30N_GCLK0_USERCCLK_2) ; also sheet 1
IO4P: U4.P8(B2:IO_L30P_GCLK1_D13_2) ; also sheet 1
IO5N: U4.T9(B2:IO_L23N_2) ; also sheet 1
IO5P: U4.R9(B2:IO_L23P_2) ; also sheet 1
IO6N: U4.N8(B2:IO_L29N_GCLK2_2) ; also sheet 1
IO6P: U4.M9(B2:IO_L29P_GCLK3_2) ; also sheet 1
IO7N: U4.M10(B2:IO_L16N_VREF_2) ; also sheet 1
IO7P: U4.L10(B2:IO_L16P_2) ; also sheet 1
IO8N: U4.T15(B1:IO_L50N_M1UDQSN_1) ; also sheet 1
IO8P: U4.R14(B1:IO_L50P_M1UDQS_1) ; also sheet 1
IRQ: U4.A14(B0:IO_L65N_SCP2_0) ; also sheet 1
LED1: U4.N16(B1:IO_L45N_A0_M1LDQSN_1) ; also sheet 1
LED2: U4.N14(B1:IO_L45P_A1_M1LDQS_1) ; also sheet 1
LED3: U4.M14(B1:IO_L74N_DOUT_BUSY_1) ; also sheet 1
LED4: U4.M13(B1:IO_L74P_AWAKE_1) ; also sheet 1
LED5: U4.L12(B1:IO_L53P_1) ; also sheet 1
LED6: U4.L13(B1:IO_L53N_VREF_1) ; also sheet 1
LED7: U4.L14(B1:IO_L47P_FWE_B_M1DQ0_1) ; also sheet 1
LED8: U4.L16(B1:IO_L47N_LDC_M1DQ1_1) ; also sheet 1
MISO: U4.C10(B0:IO_L37N_GCLK12_0) ; also sheet 1
MOSI: U4.D8(B0:IO_L38P_0) ; also sheet 1
N$2: LD11.-(C) R9.1
N$3: R10.1 U4.C4(B0:IO_L1P_HSWAPEN_0)
NE: U4.C8(B0:IO_L38N_VREF_0) ; also sheet 1
OE: U4.B6(B0:IO_L4P_0) ; also sheet 3
OSC_IN: U4.J16(B1:IO_L43N_GCLK4_M1DQ5_1) ; also sheet 1
PMOD2-IO1: U4.A8(B0:IO_L33N_0) ; also sheet 1
PMOD2-IO2: U4.A9(B0:IO_L34N_GCLK18_0) ; also sheet 1
PMOD2-IO3: U4.B8(B0:IO_L33P_0) ; also sheet 1
PMOD2-IO4: U4.C9(B0:IO_L34P_GCLK19_0) ; also sheet 1
PROGRAM_B: R23.2 U4.T2(B2:PROGRAM_B_2)
RED0: U4.B10(B0:IO_L35P_GCLK17_0) ; also sheet 1
RED1: U4.A10(B0:IO_L35N_GCLK16_0) ; also sheet 1
RED2: U4.C11(B0:IO_L39P_0) ; also sheet 1
RTS: U4.C15(B1:IO_L33P_A15_M1A10_1) ; also sheet 2
RXD: U4.B15(B1:IO_L29P_A23_M1A13_1) ; also sheet 2
SCK: U4.D9(B0:IO_L40N_0) ; also sheet 1
SD-DET: U4.J14(B1:IO_L43P_GCLK5_M1DQ4_1) ; also sheet 1
SD-LED: U4.H13(B1:IO_L39P_M1A3_1) ; also sheet 1
SS: U4.F9(B0:IO_L40P_0) ; also sheet 1
SW1: U4.G14(B1:IO_L36P_A9_M1BA0_1) ; also sheet 1
SW2: U4.G16(B1:IO_L36N_A8_M1BA1_1) ; also sheet 1
SW3: U4.F15(B1:IO_L35P_A11_M1A7_1) ; also sheet 1
SW4: U4.F16(B1:IO_L35N_A10_M1A2_1) ; also sheet 1
SW5: U4.E15(B1:IO_L34P_A13_M1WE_1) ; also sheet 1
SW6: U4.E16(B1:IO_L34N_A12_M1BA2_1) ; also sheet 1
SW7: U4.D14(B1:IO_L31P_A19_M1CKE_1) ; also sheet 1
SW8: U4.D16(B1:IO_L31N_A18_M1A12_1) ; also sheet 1
TCK: SV1.3 U4.C14(BNA:TCK) ; also sheet 2
TDI: SV1.5 U4.C12(BNA:TDI) ; also sheet 2
TDO: SV1.4 U4.E14(BNA:TDO) ; also sheet 2
TMS: SV1.6 U4.A15(BNA:TMS) ; also sheet 2
TXD: U4.B16(B1:IO_L29N_A22_M1A14_1) ; also sheet 2
VSYNC: U4.E11(B0:IO_L64N_SCP4_0) ; also sheet 1
WE: U4.J1(B3:IO_L38N_M3DQ3_3) ; also sheet 3
Unconnected: U4.B14(B0:IO_L65P_SCP3_0) U4.C6(B0:IO_L7N_0) U4.D12(B0:IO_L66N_SCP0_0) U4.E6(B0:IO_L5N_0) U4.E7(B0:IO_L36P_GCLK15_0) U4.E8(B0:IO_L36N_GCLK14_0) U4.E10(B0:IO_L37P_GCLK13_0) U4.F5(B3:IO_L55N_M3A14_3) U4.F6(B3:IO_L55P_M3A13_3) U4.F7(B0:IO_L5P_0) U4.F10(B0:IO_L64P_SCP5_0) U4.F12(B1:IO_L30P_A21_M1RESET_1) U4.G5(B3:IO_L51N_M3A4_3) U4.G6(B3:IO_L51P_M3A10_3) U4.G11(B1:IO_L30N_A20_M1A11_1) U4.G12(B1:IO_L38P_A5_M1CLK_1) U4.H5(B3:IO_L43N_GCLK22_IRDY2_M3CASN_3) U4.H11(B1:IO_L38N_A4_M1CLKN_1) U4.H14(B1:IO_L39N_M1ODT_1) U4.J6(B3:IO_L43P_GCLK23_M3RASN_3) U4.J11(B1:IO_L40P_GCLK11_M1A5_1) U4.J12(B1:IO_L40N_GCLK10_M1A6_1) U4.J13(B1:IO_L41P_GCLK9_IRDY1_M1RASN_1) U4.K3(B3:IO_L42P_GCLK25_TRDY2_M3UDM_3) U4.K5(B3:IO_L47P_M3A0_3) U4.K6(B3:IO_L47N_M3A1_3) U4.K11(B1:IO_L42N_GCLK6_TRDY1_M1LDM_1) U4.K12(B1:IO_L42P_GCLK7_M1UDM_1) U4.L7(B2:IO_L62N_D6_2) U4.L8(B2:IO_L62P_D5_2) U4.L11(B2:CMPCS_B_2) U4.M3(B3:IO_L1N_VREF_3) U4.M4(B3:IO_L1P_3) U4.M5(B3:IO_L2P_3) U4.M11(B2:IO_L2N_CMPMOSI_2) U4.M12(B2:IO_L2P_CMPCLK_2) U4.M15(B1:IO_L46P_FCS_B_M1DQ2_1) U4.M16(B1:IO_L46N_FOE_B_M1DQ3_1) U4.N4(B3:IO_L2N_3) U4.N9(B2:IO_L14P_D11_2) U4.P9(B2:IO_L14N_D12_2) U4.P11(B2:IO_L13N_D10_2) U4.P14(BNA:SUSPEND) U4.P15(B1:IO_L48P_HDC_M1DQ8_1) U4.P16(B1:IO_L48N_M1DQ9_1) U4.R12(B1:IO_L52P_M1DQ14_1) U4.R15(B1:IO_L49P_M1DQ10_1) U4.R16(B1:IO_L49N_M1DQ11_1) U4.T12(B1:IO_L52N_M1DQ15_1) U4.T13(B1:IO_L51N_M1DQ13_1) U4.T14(B1:IO_L51P_M1DQ12_1)

### Notes on the sheet
- Saanlima Electronics
- Copyright Saanlima Electronics 2015

## Library data of the parts
C1-C33 C36 C37 = saanlima:C
C34 C35 = dan-rcl:C
F1 = SparkFun:PTC: Resettable Fuse PTC Resettable Fuse. Spark Fun Electronics SKU : COM-08357
J1 J7 = saanlima:MA04-2
J2 = SparkFun:USD-SOCKET: microSD Socket Push-push type uSD socket. Schematic element and footprint production proven. Spark Fun Electronics SKU : PRT-00127. tDoc lines correctly indicate media card edge positions when inserting (unlocked, locked, depressed).
J3 = saanlima:AUDIO-JACK3
J4 J5 = SparkFun:MINI-DIN6: mini DIN 6 Connector Commonly found on the back of a computer for PS2 keyboard and mice. Schematic and footprint are proven. Spark Fun Electronics SKU : PRT-08509
J6 = SparkFun-Connectors:DB15: DB15 / VGA right angle through-hole female connector.
J8 = saanlima:MA10-2: PIN HEADER; OC_FARNELL: unknown; OC_NEWARK: unknown
J9 = SparkFun:USB: USB Connectors USB-B-PTH is fully proven SKU : PRT-00139 USB-miniB is fully proven SKU : PRT-00587 USB-A-PCB is untested. USB-A-H is throughly reviewed, but untested. Spark Fun Electronics SKU : PRT-00437 USB-B-SMT is throughly reviewed, but untested. Needs silkscreen touching up. USB-A-S has not been used/tested USB-MB-H has not been used/tested
JP1-JP8 = SparkFun:FIDUCIAL: Fiducial Alignment Points Various fiducial points for machine vision alignment.
L1-L3 = saanlima:FERRITE: Ferrite Bead
LD1-LD11 = saanlima:LED: LED
R1-R34 R37 = saanlima:R
R35 R36 R38-R40 = dan-rcl:R
S1 = switch-dil:219-08*: Surface Mount DIP Switch Series 219 SMT CTS Electronic Components Sourc: www.ctscorp.com; OC_FARNELL: unknown; OC_NEWARK: unknown
S2 = saanlima:SWITCH-MOMENTARY-2
SV1 = saanlima:MA06-1: PIN HEADER
U1 = jfrc:OSCILLATOR
U2 = GadgetFactory:FLASH-SPI-25XX: SPI Flash
U3 U9 = Bogdan_Commons:DIGITAL_4MB_SRAM
U4 = xilinx_devices:6SLX9FTG256: Xilinx FPGA: 6SLX9FTG256
U5 U6 = SparkFun:V_REG_LM1117: Voltage Regulator LM1117 Standard adjustable voltage regulator but in SMD form. Spark Fun Electronics SKU : COM-00595
U7 = rsr:DP-EAGLELIBRARY_FT2232H: DUAL HIGH SPEED USB TO MULTIPURPOSE UART/FIFO IC
U8 = Bogdan_Commons:DIGITAL-EEPROM-MICROWIRE-6P
X1 = jfrc:CRYSTAL: Crystals Various standard crystals. Proven footprints. Spark Fun Electronics SKU : COM-00534

## Net classes
1 power: width 0.203 mm